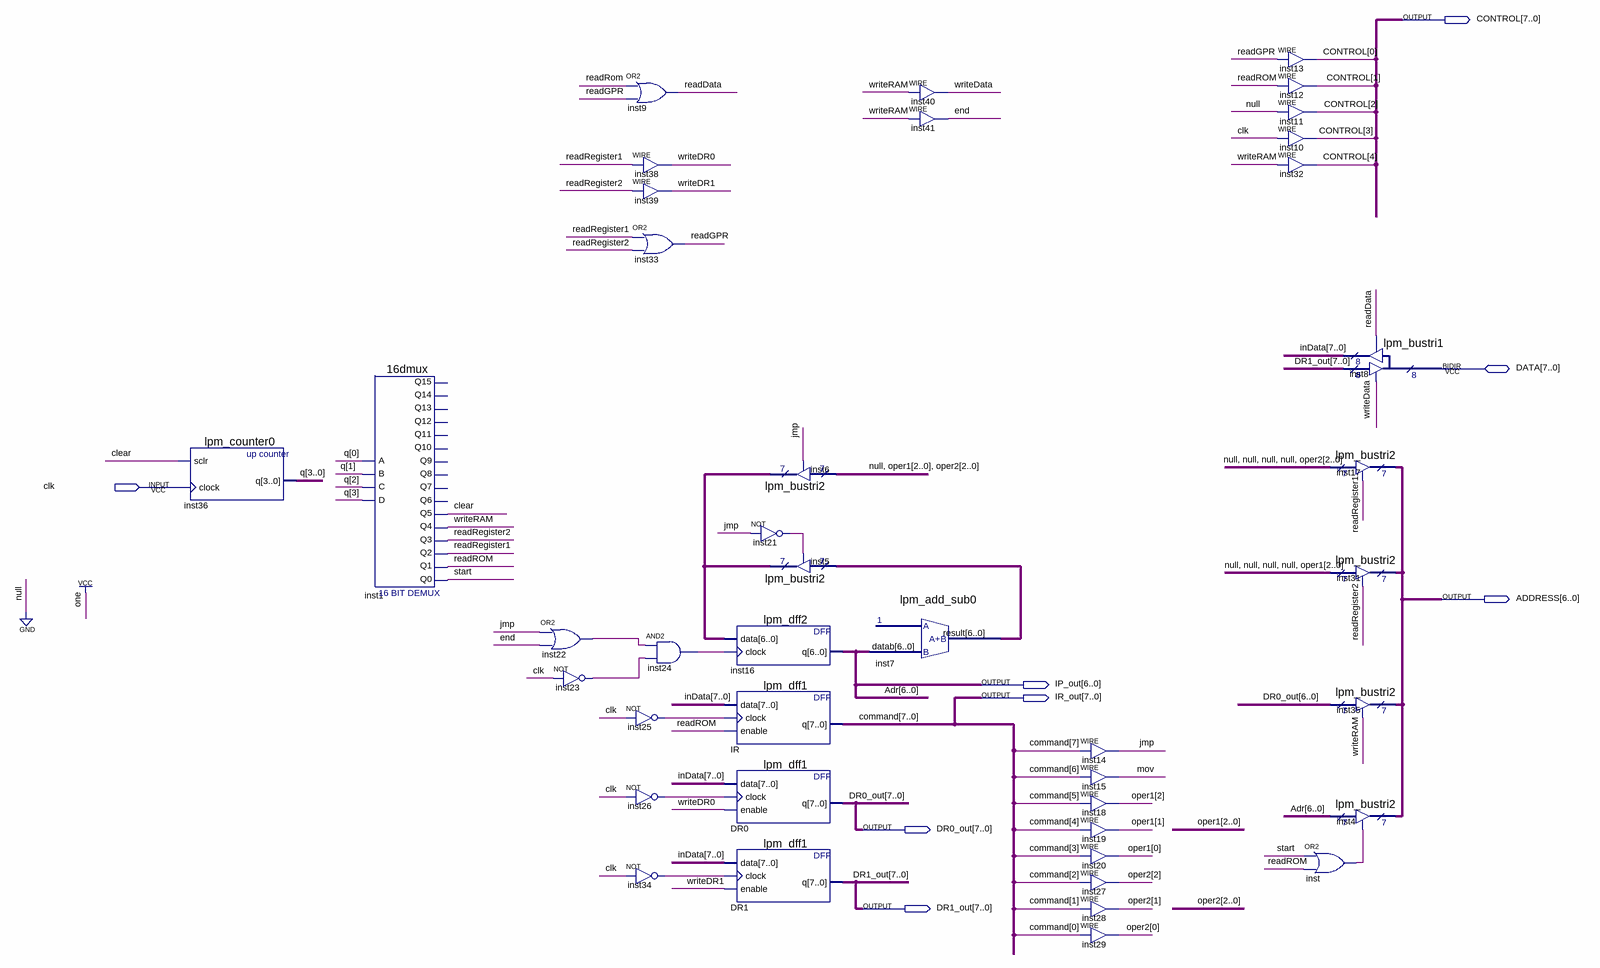
[diagram p0: schematic sheet]
// Quartus schematic CU.bdf as structural Verilog: 41 symbols, 8 pins
module CU (
  input  clk,
  inout  [7:0] DATA,
  output [7:0] CONTROL,
  output [6:0] ADDRESS,
  output [6:0] IP_out,
  output [7:0] IR_out,
  output [7:0] DR0_out,
  output [7:0] DR1_out
);

  wire clear, \end , inst21_out, inst22_out, inst23_out, inst24_out, inst25_out, inst26_out, inst34_out,
       inst_out, jmp, mov, readData, readGPR, readRegister1, readRegister2, readROM, start, writeData,
       writeDR0, writeDR1, writeRAM;
  wire [2:0] oper1, oper2;
  wire [3:0] q;
  wire [6:0] inst6_tridata, inst7_result;
  wire [7:0] inData;

  lpm_counter0 inst36 (.sclr(clear), .clock(clk), .q(q));
  \16dmux  inst1 (
    .C(q[2]), .B(q[1]), .A(q[0]), .D(q[3]), .Q4(writeRAM), .Q5(clear), .Q2(readRegister1),
    .Q3(readRegister2), .Q0(start), .Q1(readROM));  // open: Q12, Q13, Q11, Q9, Q10, Q7, Q8, Q6, Q14, Q15
  or inst22 (inst22_out, jmp, \end );
  not inst23 (inst23_out, clk);
  or inst9 (readData, readROM, readGPR);
  assign writeDR0 = readRegister1;  // WIRE inst38
  assign writeDR1 = readRegister2;  // WIRE inst39
  or inst33 (readGPR, readRegister1, readRegister2);
  and inst24 (inst24_out, inst22_out, inst23_out);
  not inst25 (inst25_out, clk);
  not inst26 (inst26_out, clk);
  not inst34 (inst34_out, clk);
  lpm_bustri2 inst6 (.enabledt(jmp), .data({1'b0, oper1, oper2}), .tridata(inst6_tridata));
  not inst21 (inst21_out, jmp);
  lpm_bustri2 inst5 (.enabledt(inst21_out), .data(inst7_result), .tridata(inst6_tridata));
  lpm_dff2 inst16 (.data(inst6_tridata), .clock(inst24_out), .q(IP_out));
  lpm_dff1 IR (.data(inData), .clock(inst25_out), .enable(readROM), .q(IR_out));
  lpm_dff1 DR0 (.data(inData), .clock(inst26_out), .enable(writeDR0), .q(DR0_out));
  lpm_dff1 DR1 (.data(inData), .clock(inst34_out), .enable(writeDR1), .q(DR1_out));
  lpm_add_sub0 inst7 (.datab(IP_out), .result(inst7_result));
  assign writeData = writeRAM;  // WIRE inst40
  assign \end  = writeRAM;  // WIRE inst41
  assign jmp = IR_out[7];  // WIRE inst14
  assign mov = IR_out[6];  // WIRE inst15
  assign oper1[2] = IR_out[5];  // WIRE inst18
  assign oper1[1] = IR_out[4];  // WIRE inst19
  assign oper1[0] = IR_out[3];  // WIRE inst20
  assign oper2[2] = IR_out[2];  // WIRE inst27
  assign oper2[1] = IR_out[1];  // WIRE inst28
  assign oper2[0] = IR_out[0];  // WIRE inst29
  assign CONTROL[0] = readGPR;  // WIRE inst13
  assign CONTROL[1] = readROM;  // WIRE inst12
  assign CONTROL[2] = 1'b0;  // WIRE inst11
  assign CONTROL[3] = clk;  // WIRE inst10
  assign CONTROL[4] = writeRAM;  // WIRE inst32
  lpm_bustri1 inst8 (.enabledt(writeData), .data(DR1_out), .enabletr(readData), .result(inData), .tridata(DATA));
  lpm_bustri2 inst17 (.enabledt(readRegister1), .data({4'b0000, oper2}), .tridata(ADDRESS));
  lpm_bustri2 inst31 (.enabledt(readRegister2), .data({4'b0000, oper1}), .tridata(ADDRESS));
  lpm_bustri2 inst35 (.enabledt(writeRAM), .data(DR0_out[6:0]), .tridata(ADDRESS));
  lpm_bustri2 inst4 (.enabledt(inst_out), .data(IP_out), .tridata(ADDRESS));
  or inst (inst_out, start, readROM);

  // Other names for the same wires on the sheet: command[7:0] = IR_out; Adr[6:0] = IP_out
endmodule
